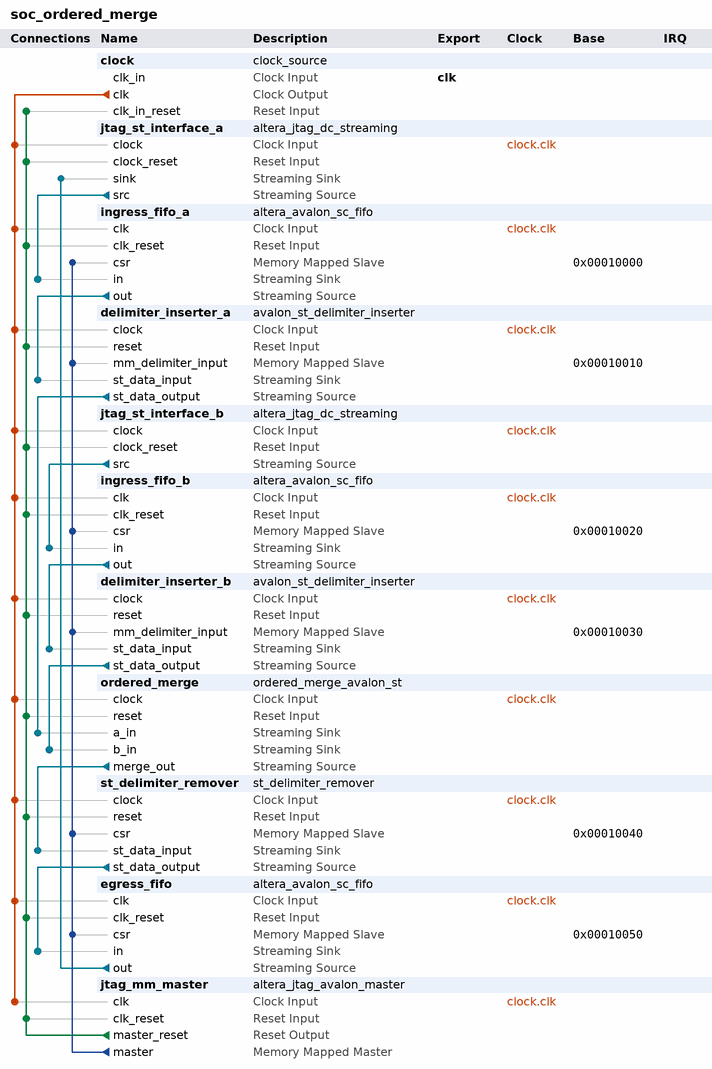
[diagram p0: system contents]
# Platform Designer (Qsys) system soc_ordered_merge, Cyclone V 5CSXFC6C6U23C8ES
# Parameters at their usual value, and those the tool derives, are not listed.
package require -exact qsys 13.1
create_system soc_ordered_merge
set_project_property DEVICE_FAMILY {Cyclone V}
set_project_property DEVICE 5CSXFC6C6U23C8ES

add_instance clock clock_source 13.1
set_instance_parameter_value clock clockFrequency 50000000

add_instance jtag_st_interface_a altera_jtag_dc_streaming 13.1
set_instance_parameter_value jtag_st_interface_a PURPOSE 0
set_instance_parameter_value jtag_st_interface_a UPSTREAM_FIFO_SIZE 0
set_instance_parameter_value jtag_st_interface_a DOWNSTREAM_FIFO_SIZE 0
set_instance_parameter_value jtag_st_interface_a MGMT_CHANNEL_WIDTH -1
set_instance_parameter_value jtag_st_interface_a USE_PLI 0
set_instance_parameter_value jtag_st_interface_a PLI_PORT 50000
set_instance_parameter_value jtag_st_interface_a USE_DOWNSTREAM_READY 0
set_instance_parameter_value jtag_st_interface_a COMPONENT_CLOCK 50000000
set_instance_parameter_value jtag_st_interface_a FABRIC 2.0

add_instance ingress_fifo_a altera_avalon_sc_fifo 13.1
set_instance_parameter_value ingress_fifo_a BITS_PER_SYMBOL 8
set_instance_parameter_value ingress_fifo_a FIFO_DEPTH 16
set_instance_parameter_value ingress_fifo_a CHANNEL_WIDTH 0
set_instance_parameter_value ingress_fifo_a ERROR_WIDTH 0
set_instance_parameter_value ingress_fifo_a USE_FILL_LEVEL 1
set_instance_parameter_value ingress_fifo_a USE_MEMORY_BLOCKS 1
set_instance_parameter_value ingress_fifo_a USE_STORE_FORWARD 0

add_instance delimiter_inserter_a avalon_st_delimiter_inserter 1.0
set_instance_parameter_value delimiter_inserter_a WIDTH 8

add_instance jtag_st_interface_b altera_jtag_dc_streaming 13.1
set_instance_parameter_value jtag_st_interface_b PURPOSE 0
set_instance_parameter_value jtag_st_interface_b UPSTREAM_FIFO_SIZE 0
set_instance_parameter_value jtag_st_interface_b DOWNSTREAM_FIFO_SIZE 0
set_instance_parameter_value jtag_st_interface_b MGMT_CHANNEL_WIDTH -1
set_instance_parameter_value jtag_st_interface_b USE_PLI 0
set_instance_parameter_value jtag_st_interface_b PLI_PORT 50000
set_instance_parameter_value jtag_st_interface_b USE_DOWNSTREAM_READY 0
set_instance_parameter_value jtag_st_interface_b COMPONENT_CLOCK 50000000
set_instance_parameter_value jtag_st_interface_b FABRIC 2.0

add_instance ingress_fifo_b altera_avalon_sc_fifo 13.1
set_instance_parameter_value ingress_fifo_b BITS_PER_SYMBOL 8
set_instance_parameter_value ingress_fifo_b FIFO_DEPTH 16
set_instance_parameter_value ingress_fifo_b CHANNEL_WIDTH 0
set_instance_parameter_value ingress_fifo_b ERROR_WIDTH 0
set_instance_parameter_value ingress_fifo_b USE_FILL_LEVEL 1
set_instance_parameter_value ingress_fifo_b USE_MEMORY_BLOCKS 1
set_instance_parameter_value ingress_fifo_b USE_STORE_FORWARD 0

add_instance delimiter_inserter_b avalon_st_delimiter_inserter 1.0
set_instance_parameter_value delimiter_inserter_b WIDTH 8

add_instance ordered_merge ordered_merge_avalon_st 1.0
set_instance_parameter_value ordered_merge WIDTH 8
set_instance_parameter_value ordered_merge END_PACKET_VALUE 255

add_instance st_delimiter_remover st_delimiter_remover 1.0
set_instance_parameter_value st_delimiter_remover WIDTH 8
set_instance_parameter_value st_delimiter_remover DELIMITER_VALUE_PASSTHRU 1

add_instance egress_fifo altera_avalon_sc_fifo 13.1
set_instance_parameter_value egress_fifo BITS_PER_SYMBOL 8
set_instance_parameter_value egress_fifo FIFO_DEPTH 16
set_instance_parameter_value egress_fifo CHANNEL_WIDTH 0
set_instance_parameter_value egress_fifo ERROR_WIDTH 0
set_instance_parameter_value egress_fifo USE_FILL_LEVEL 1
set_instance_parameter_value egress_fifo USE_MEMORY_BLOCKS 1
set_instance_parameter_value egress_fifo USE_STORE_FORWARD 0

add_instance jtag_mm_master altera_jtag_avalon_master 13.1

# connections
add_connection clock.clk delimiter_inserter_a.clock clock
add_connection clock.clk delimiter_inserter_b.clock clock
add_connection clock.clk egress_fifo.clk clock
add_connection clock.clk ingress_fifo_a.clk clock
add_connection clock.clk ingress_fifo_b.clk clock
add_connection clock.clk jtag_mm_master.clk clock
add_connection clock.clk jtag_st_interface_a.clock clock
add_connection clock.clk jtag_st_interface_b.clock clock
add_connection clock.clk ordered_merge.clock clock
add_connection clock.clk st_delimiter_remover.clock clock
add_connection jtag_mm_master.master_reset clock.clk_in_reset reset
add_connection jtag_mm_master.master_reset delimiter_inserter_a.reset reset
add_connection jtag_mm_master.master_reset delimiter_inserter_b.reset reset
add_connection jtag_mm_master.master_reset egress_fifo.clk_reset reset
add_connection jtag_mm_master.master_reset ingress_fifo_a.clk_reset reset
add_connection jtag_mm_master.master_reset ingress_fifo_b.clk_reset reset
add_connection jtag_mm_master.master_reset jtag_mm_master.clk_reset reset
add_connection jtag_mm_master.master_reset jtag_st_interface_a.clock_reset reset
add_connection jtag_mm_master.master_reset jtag_st_interface_b.clock_reset reset
add_connection jtag_mm_master.master_reset ordered_merge.reset reset
add_connection jtag_mm_master.master_reset st_delimiter_remover.reset reset
add_connection jtag_mm_master.master delimiter_inserter_a.mm_delimiter_input avalon
set_connection_parameter_value jtag_mm_master.master/delimiter_inserter_a.mm_delimiter_input baseAddress 0x00010010
add_connection jtag_mm_master.master delimiter_inserter_b.mm_delimiter_input avalon
set_connection_parameter_value jtag_mm_master.master/delimiter_inserter_b.mm_delimiter_input baseAddress 0x00010030
add_connection jtag_mm_master.master egress_fifo.csr avalon
set_connection_parameter_value jtag_mm_master.master/egress_fifo.csr baseAddress 0x00010050
add_connection jtag_mm_master.master ingress_fifo_a.csr avalon
set_connection_parameter_value jtag_mm_master.master/ingress_fifo_a.csr baseAddress 0x00010000
add_connection jtag_mm_master.master ingress_fifo_b.csr avalon
set_connection_parameter_value jtag_mm_master.master/ingress_fifo_b.csr baseAddress 0x00010020
add_connection jtag_mm_master.master st_delimiter_remover.csr avalon
set_connection_parameter_value jtag_mm_master.master/st_delimiter_remover.csr baseAddress 0x00010040
add_connection delimiter_inserter_a.st_data_output ordered_merge.a_in avalon_streaming
add_connection delimiter_inserter_b.st_data_output ordered_merge.b_in avalon_streaming
add_connection egress_fifo.out jtag_st_interface_a.sink avalon_streaming
add_connection ingress_fifo_a.out delimiter_inserter_a.st_data_input avalon_streaming
add_connection ingress_fifo_b.out delimiter_inserter_b.st_data_input avalon_streaming
add_connection jtag_st_interface_a.src ingress_fifo_a.in avalon_streaming
add_connection jtag_st_interface_b.src ingress_fifo_b.in avalon_streaming
add_connection ordered_merge.merge_out st_delimiter_remover.st_data_input avalon_streaming
add_connection st_delimiter_remover.st_data_output egress_fifo.in avalon_streaming

# exported interfaces
add_interface clk clock sink
set_interface_property clk EXPORT_OF clock.clk_in

set_interconnect_requirement {$system} qsys_mm.clockCrossingAdapter HANDSHAKE
set_interconnect_requirement {$system} qsys_mm.maxAdditionalLatency 1
set_interconnect_requirement {$system} qsys_mm.insertDefaultSlave false

save_system soc_ordered_merge.qsys
